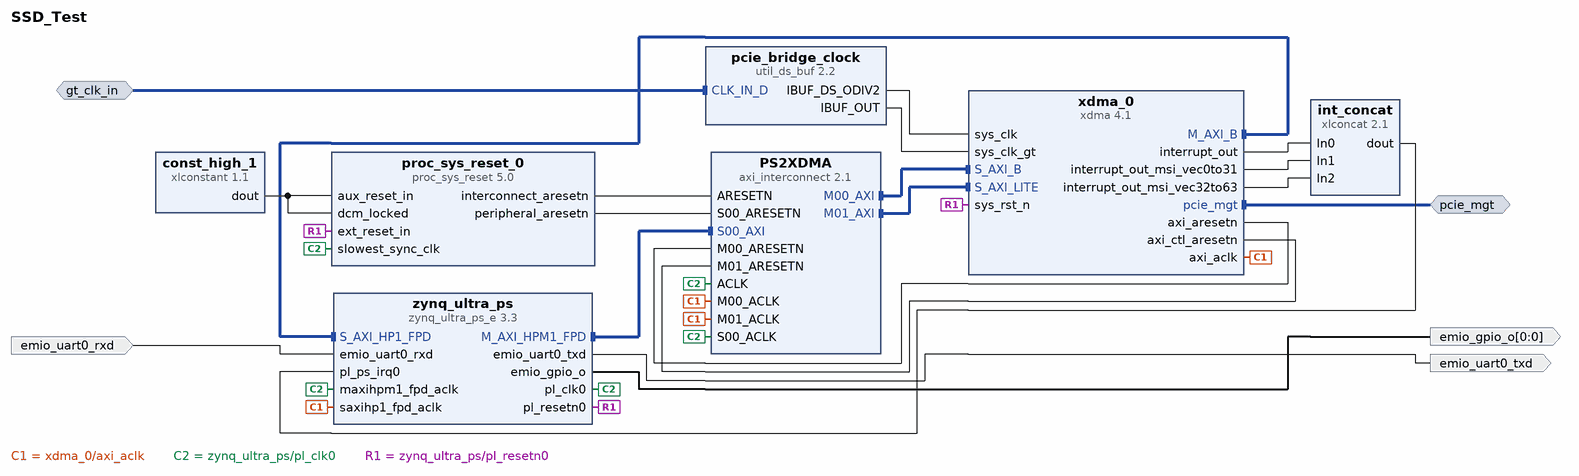
[diagram p0: block diagram of the top level]
# Vivado block design SSD_Test, xczu4ev-sfvc784-1-e, Vivado 2021.1
create_bd_design SSD_Test

create_bd_intf_port -mode Master -vlnv xilinx.com:interface:pcie_7x_mgt_rtl:1.0 pcie_mgt
create_bd_intf_port -mode Slave -vlnv xilinx.com:interface:diff_clock_rtl:1.0 gt_clk_in
create_bd_port -dir O emio_uart0_txd
create_bd_port -dir I emio_uart0_rxd
create_bd_port -dir O -from 0 -to 0 emio_gpio_o

create_bd_cell -type ip -vlnv xilinx.com:ip:axi_interconnect:2.1 PS2XDMA
set_property -dict {CONFIG.STRATEGY 1} [get_bd_cells PS2XDMA]
create_bd_cell -type ip -vlnv xilinx.com:ip:xlconstant:1.1 const_high_1
create_bd_cell -type ip -vlnv xilinx.com:ip:xlconcat:2.1 int_concat
set_property -dict {CONFIG.NUM_PORTS 3} [get_bd_cells int_concat]
create_bd_cell -type ip -vlnv xilinx.com:ip:proc_sys_reset:5.0 proc_sys_reset_0
create_bd_cell -type ip -vlnv xilinx.com:ip:util_ds_buf:2.2 pcie_bridge_clock
set_property -dict {CONFIG.C_BUF_TYPE IBUFDSGTE} [get_bd_cells pcie_bridge_clock]
create_bd_cell -type ip -vlnv xilinx.com:ip:xdma:4.1 xdma_0
set_property -dict [list \
  CONFIG.BASEADDR 0x00000000 \
  CONFIG.HIGHADDR 0x001FFFFF \
  CONFIG.INS_LOSS_NYQ 15 \
  CONFIG.PF0_DEVICE_ID_mqdma 9034 \
  CONFIG.PF0_SRIOV_VF_DEVICE_ID A034 \
  CONFIG.PF2_DEVICE_ID_mqdma 9234 \
  CONFIG.PF3_DEVICE_ID_mqdma 9334 \
  CONFIG.axi_addr_width 40 \
  CONFIG.axi_data_width 128_bit \
  CONFIG.axisten_freq 250 \
  CONFIG.bridge_burst true \
  CONFIG.c_s_axi_supports_narrow_burst true \
  CONFIG.device_port_type Root_Port_of_PCI_Express_Root_Complex \
  CONFIG.dma_reset_source_sel Phy_Ready \
  CONFIG.functional_mode AXI_Bridge \
  CONFIG.ins_loss_profile Add-in_Card \
  CONFIG.mode_selection Advanced \
  CONFIG.msi_rx_pin_en TRUE \
  CONFIG.pcie_blk_locn X0Y1 \
  CONFIG.pf0_bar0_enabled false \
  CONFIG.pf0_bar0_type_mqdma Memory \
  CONFIG.pf0_base_class_menu Bridge_device \
  CONFIG.pf0_base_class_menu_mqdma Bridge_device \
  CONFIG.pf0_class_code_base_mqdma 06 \
  CONFIG.pf0_class_code_interface 00 \
  CONFIG.pf0_class_code_sub 07 \
  CONFIG.pf0_device_id 9134 \
  CONFIG.pf0_sriov_bar0_type Memory \
  CONFIG.pf0_sub_class_interface_menu CardBus_bridge \
  CONFIG.pf1_bar0_type_mqdma Memory \
  CONFIG.pf1_base_class_menu Bridge_device \
  CONFIG.pf1_base_class_menu_mqdma Bridge_device \
  CONFIG.pf1_class_code_base_mqdma 06 \
  CONFIG.pf1_class_code_interface 00 \
  CONFIG.pf1_class_code_sub 07 \
  CONFIG.pf1_sub_class_interface_menu CardBus_bridge \
  CONFIG.pf2_bar0_type_mqdma Memory \
  CONFIG.pf2_base_class_menu_mqdma Bridge_device \
  CONFIG.pf2_class_code_base_mqdma 06 \
  CONFIG.pf3_bar0_type_mqdma Memory \
  CONFIG.pf3_base_class_menu_mqdma Bridge_device \
  CONFIG.pf3_class_code_base_mqdma 06 \
  CONFIG.pl_link_cap_max_link_speed 8.0_GT/s \
  CONFIG.pl_link_cap_max_link_width X4 \
  CONFIG.plltype QPLL1 \
  CONFIG.type1_membase_memlimit_enable Enabled \
  CONFIG.type1_prefetchable_membase_memlimit 64bit_Enabled \
] [get_bd_cells xdma_0]
create_bd_cell -type ip -vlnv xilinx.com:ip:zynq_ultra_ps_e:3.3 zynq_ultra_ps
set_property -dict [list \
  CONFIG.PSU_BANK_0_IO_STANDARD LVCMOS18 \
  CONFIG.PSU_BANK_1_IO_STANDARD LVCMOS18 \
  CONFIG.PSU_BANK_2_IO_STANDARD LVCMOS18 \
  CONFIG.PSU_BANK_3_IO_STANDARD LVCMOS18 \
  CONFIG.PSU__CRF_APB__DDR_CTRL__FREQMHZ 1200 \
  CONFIG.PSU__CRL_APB__PL0_REF_CTRL__FREQMHZ 250 \
  CONFIG.PSU__DDRC__DEVICE_CAPACITY {4096 MBits} \
  CONFIG.PSU__DDRC__DRAM_WIDTH {16 Bits} \
  CONFIG.PSU__DDRC__SPEED_BIN DDR4_2400R \
  CONFIG.PSU__DDR_HIGH_ADDRESS_GUI_ENABLE 0 \
  CONFIG.PSU__DDR__INTERFACE__FREQMHZ 600.000 \
  CONFIG.PSU__GPIO_EMIO__PERIPHERAL__ENABLE 1 \
  CONFIG.PSU__GPIO_EMIO__PERIPHERAL__IO 1 \
  CONFIG.PSU__PRESET_APPLIED 1 \
  CONFIG.PSU__PSS_REF_CLK__FREQMHZ 33.33333 \
  CONFIG.PSU__QSPI_COHERENCY 0 \
  CONFIG.PSU__QSPI_ROUTE_THROUGH_FPD 0 \
  CONFIG.PSU__QSPI__GRP_FBCLK__ENABLE 1 \
  CONFIG.PSU__QSPI__GRP_FBCLK__IO {MIO 6} \
  CONFIG.PSU__QSPI__PERIPHERAL__DATA_MODE x4 \
  CONFIG.PSU__QSPI__PERIPHERAL__ENABLE 1 \
  CONFIG.PSU__QSPI__PERIPHERAL__IO {MIO 0 .. 5} \
  CONFIG.PSU__QSPI__PERIPHERAL__MODE Single \
  CONFIG.PSU__SWDT0__CLOCK__ENABLE 0 \
  CONFIG.PSU__SWDT0__PERIPHERAL__ENABLE 1 \
  CONFIG.PSU__SWDT0__RESET__ENABLE 0 \
  CONFIG.PSU__SWDT1__CLOCK__ENABLE 0 \
  CONFIG.PSU__SWDT1__PERIPHERAL__ENABLE 1 \
  CONFIG.PSU__SWDT1__RESET__ENABLE 0 \
  CONFIG.PSU__TTC0__CLOCK__ENABLE 0 \
  CONFIG.PSU__TTC0__PERIPHERAL__ENABLE 1 \
  CONFIG.PSU__TTC0__WAVEOUT__ENABLE 0 \
  CONFIG.PSU__TTC1__CLOCK__ENABLE 0 \
  CONFIG.PSU__TTC1__PERIPHERAL__ENABLE 1 \
  CONFIG.PSU__TTC1__WAVEOUT__ENABLE 0 \
  CONFIG.PSU__TTC2__CLOCK__ENABLE 0 \
  CONFIG.PSU__TTC2__PERIPHERAL__ENABLE 1 \
  CONFIG.PSU__TTC2__WAVEOUT__ENABLE 0 \
  CONFIG.PSU__TTC3__CLOCK__ENABLE 0 \
  CONFIG.PSU__TTC3__PERIPHERAL__ENABLE 1 \
  CONFIG.PSU__TTC3__WAVEOUT__ENABLE 0 \
  CONFIG.PSU__UART0__BAUD_RATE 115200 \
  CONFIG.PSU__UART0__MODEM__ENABLE 0 \
  CONFIG.PSU__UART0__PERIPHERAL__ENABLE 1 \
  CONFIG.PSU__UART0__PERIPHERAL__IO EMIO \
  CONFIG.PSU__USE__IRQ0 1 \
  CONFIG.PSU__USE__M_AXI_GP1 1 \
  CONFIG.PSU__USE__M_AXI_GP2 0 \
  CONFIG.PSU__USE__S_AXI_GP3 1 \
] [get_bd_cells zynq_ultra_ps]
# 49 more settings of zynq_ultra_ps are not shown: defaults, MIO pin electricals, DDR timing, and values the tool derives

# ---- connections ----

connect_bd_intf_net -intf_net CLK_IN_D_0_1 [get_bd_intf_ports gt_clk_in] [get_bd_intf_pins pcie_bridge_clock/CLK_IN_D]
connect_bd_intf_net [get_bd_intf_pins PS2XDMA/M00_AXI] [get_bd_intf_pins xdma_0/S_AXI_B]
connect_bd_intf_net [get_bd_intf_pins PS2XDMA/M01_AXI] [get_bd_intf_pins xdma_0/S_AXI_LITE]
connect_bd_intf_net [get_bd_intf_pins xdma_0/M_AXI_B] [get_bd_intf_pins zynq_ultra_ps/S_AXI_HP1_FPD]
connect_bd_intf_net [get_bd_intf_ports pcie_mgt] [get_bd_intf_pins xdma_0/pcie_mgt]
connect_bd_intf_net -intf_net zynq_ultra_ps_e_0_M_AXI_HPM1_FPD [get_bd_intf_pins zynq_ultra_ps/M_AXI_HPM1_FPD] [get_bd_intf_pins PS2XDMA/S00_AXI]
connect_bd_net [get_bd_pins const_high_1/dout] [get_bd_pins proc_sys_reset_0/aux_reset_in] [get_bd_pins proc_sys_reset_0/dcm_locked]
connect_bd_net [get_bd_ports emio_uart0_rxd] [get_bd_pins zynq_ultra_ps/emio_uart0_rxd]
connect_bd_net [get_bd_pins int_concat/dout] [get_bd_pins zynq_ultra_ps/pl_ps_irq0]
connect_bd_net [get_bd_pins pcie_bridge_clock/IBUF_DS_ODIV2] [get_bd_pins xdma_0/sys_clk]
connect_bd_net [get_bd_pins pcie_bridge_clock/IBUF_OUT] [get_bd_pins xdma_0/sys_clk_gt]
connect_bd_net [get_bd_pins proc_sys_reset_0/interconnect_aresetn] [get_bd_pins PS2XDMA/ARESETN]
connect_bd_net [get_bd_pins proc_sys_reset_0/peripheral_aresetn] [get_bd_pins PS2XDMA/S00_ARESETN]
connect_bd_net [get_bd_pins xdma_0/axi_aclk] \
  [get_bd_pins PS2XDMA/M00_ACLK] [get_bd_pins PS2XDMA/M01_ACLK] [get_bd_pins zynq_ultra_ps/saxihp1_fpd_aclk]
connect_bd_net [get_bd_pins xdma_0/axi_aresetn] [get_bd_pins PS2XDMA/M00_ARESETN]
connect_bd_net [get_bd_pins xdma_0/axi_ctl_aresetn] [get_bd_pins PS2XDMA/M01_ARESETN]
connect_bd_net [get_bd_pins xdma_0/interrupt_out] [get_bd_pins int_concat/In0]
connect_bd_net [get_bd_pins xdma_0/interrupt_out_msi_vec0to31] [get_bd_pins int_concat/In1]
connect_bd_net [get_bd_pins xdma_0/interrupt_out_msi_vec32to63] [get_bd_pins int_concat/In2]
connect_bd_net -net zynq_ultra_ps_e_0_emio_uart0_txd [get_bd_pins zynq_ultra_ps/emio_uart0_txd] [get_bd_ports emio_uart0_txd]
connect_bd_net -net zynq_ultra_ps_e_0_pl_clk0 [get_bd_pins zynq_ultra_ps/pl_clk0] \
  [get_bd_pins zynq_ultra_ps/maxihpm1_fpd_aclk] [get_bd_pins PS2XDMA/S00_ACLK] [get_bd_pins PS2XDMA/ACLK] \
  [get_bd_pins proc_sys_reset_0/slowest_sync_clk]
connect_bd_net [get_bd_pins zynq_ultra_ps/emio_gpio_o] [get_bd_ports emio_gpio_o]
connect_bd_net [get_bd_pins zynq_ultra_ps/pl_resetn0] [get_bd_pins proc_sys_reset_0/ext_reset_in] [get_bd_pins xdma_0/sys_rst_n]

# ---- address map ----
assign_bd_address -offset 0x0000000000 -range 2G -target_address_space [get_bd_addr_spaces xdma_0/M_AXI_B] [get_bd_addr_segs zynq_ultra_ps/SAXIGP3/HP1_DDR_LOW]
assign_bd_address -offset 0x00C0000000 -range 512M -target_address_space [get_bd_addr_spaces xdma_0/M_AXI_B] [get_bd_addr_segs zynq_ultra_ps/SAXIGP3/HP1_QSPI]
assign_bd_address -offset 0x00FF000000 -range 16M -target_address_space [get_bd_addr_spaces xdma_0/M_AXI_B] [get_bd_addr_segs zynq_ultra_ps/SAXIGP3/HP1_LPS_OCM]
assign_bd_address -offset 0x00B0000000 -range 256M -target_address_space [get_bd_addr_spaces zynq_ultra_ps/Data] [get_bd_addr_segs xdma_0/S_AXI_B/BAR0]
assign_bd_address -offset 0x0500000000 -range 512M -target_address_space [get_bd_addr_spaces zynq_ultra_ps/Data] [get_bd_addr_segs xdma_0/S_AXI_LITE/CTL0]

validate_bd_design
save_bd_design
